# Altium schematic sheet P03_Design_Block_Diagram.SchDoc
size A4
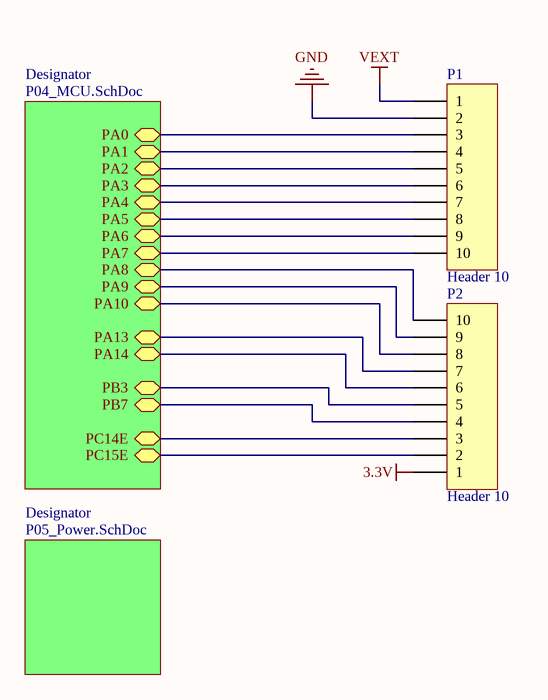
[diagram p0: P03_Design_Block_Diagram.SchDoc]

## Parts
P1  Header 10  [HDR_1_10_M_180]
P2  Header 10  [HDR_1_10_M_180]

## Sub-sheets
Designator = P04_MCU.SchDoc: PA0, PA1, PA2, PA3, PA4, PA5, PA6, PA7, PA8, PA9, PA10, PB3, PB7, PA13, PA14, PC14E, PC15E
Designator = P05_Power.SchDoc: no entries

## Nets
3.3V: P2.1
GND: P1.2
VEXT: P1.1
NetP1_3: P1.3 ; sheet Designator/PA0
NetP1_4: P1.4 ; sheet Designator/PA1
NetP1_5: P1.5 ; sheet Designator/PA2
NetP1_6: P1.6 ; sheet Designator/PA3
NetP1_7: P1.7 ; sheet Designator/PA4
NetP1_8: P1.8 ; sheet Designator/PA5
NetP1_9: P1.9 ; sheet Designator/PA6
NetP1_10: P1.10 ; sheet Designator/PA7
NetP2_2: P2.2 ; sheet Designator/PC15E
NetP2_3: P2.3 ; sheet Designator/PC14E
NetP2_4: P2.4 ; sheet Designator/PB7
NetP2_5: P2.5 ; sheet Designator/PB3
NetP2_6: P2.6 ; sheet Designator/PA14
NetP2_7: P2.7 ; sheet Designator/PA13
NetP2_8: P2.8 ; sheet Designator/PA10
NetP2_9: P2.9 ; sheet Designator/PA9
NetP2_10: P2.10 ; sheet Designator/PA8

## Library data of the parts
P1 P2 = Header 10: Header, 10-Pin; LatestRevisionDate: 17-Jul-2002; LatestRevisionNote: Re-released for DXP Platform.; Publisher: Altium Limited